# EAGLE schematic Sensirion_flowSensor (EAGLE 9.6.2)
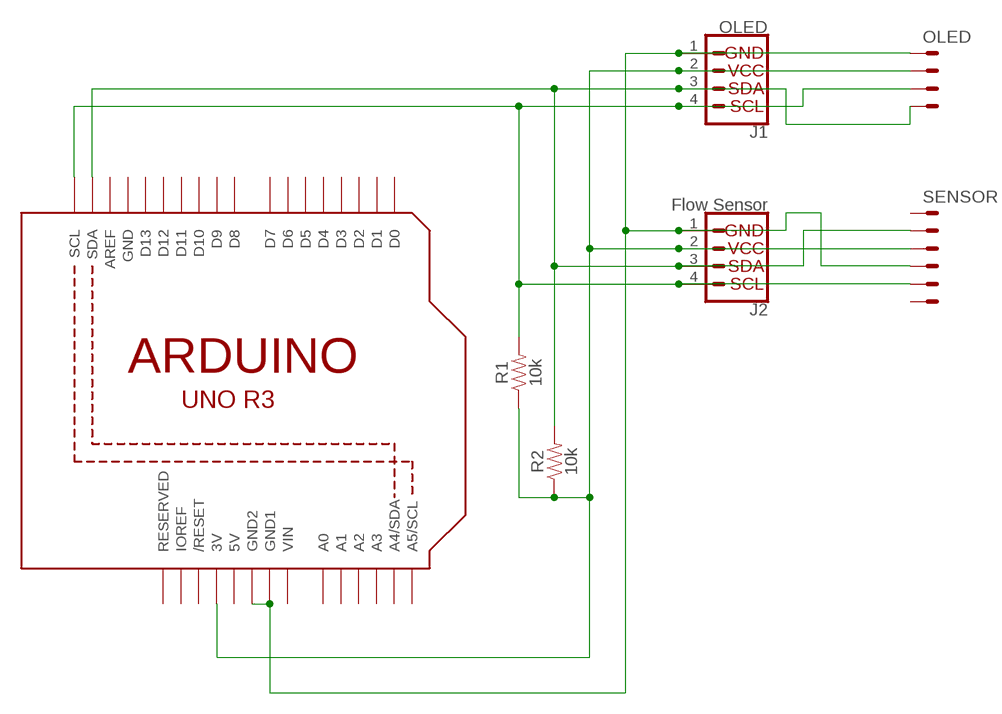
[diagram p0: schematic, sheet 1]

## Parts
FLOW  SENSOR  KK-156-6  [KK-156-6]
J1  OLED  QWIIC_CONNECTOR  [JST04_1MM_VERT]
J2  Flow Sensor  QWIIC_CONNECTOR  [JST04_1MM_VERT]
OLED  OLED  KK-156-4  [KK-156-4]
R1  10k  10KOHM-VERT-1/4W-1%  [AXIAL-0.1]
R2  10k  10KOHM-VERT-1/4W-1%  [AXIAL-0.1]
U1  ARDUINOR3-BPLACE  [ARDUINOR3-BPLACE]

## Nets
N$1: FLOW.5 J1.4 J2.4 OLED.3 R1.P$2 U1.SCL
N$2: FLOW.2 J1.3 J2.3 OLED.4 R2.P$2 U1.SDA
N$5: FLOW.3 J1.2 J2.2 OLED.2 R1.P$1 R2.P$1 U1.3V
N$6: FLOW.4 J1.1 J2.1 OLED.1 U1.GND1 U1.GND2
Unconnected: FLOW.1 FLOW.6 U1.A0 U1.A1 U1.A2 U1.A3 U1.A4(A4/SDA) U1.A5(A5/SCL) U1.AREF U1.D0 U1.D1 U1.D2 U1.D3 U1.D4 U1.D5 U1.D6 U1.D7 U1.D8 U1.D9 U1.D10 U1.D11 U1.D12 U1.D13 U1.IOREF U1.RESERVED U1.RESET(/RESET)

## Power pins joined to a net without a drawn wire
5V: U1.5V
GND: U1.GND
VIN: U1.VIN

## Library data of the parts
FLOW = con-molex:KK-156-6: KK 156 HEADER Source: http://www.molex.com/pdm_docs/sd/026604100_sd.pdf; MF: MOLEX; OC_FARNELL: unknown; OC_NEWARK: unknown
J1 J2 = SparkFun-Connectors:QWIIC_CONNECTOR: SparkFun I2C Standard Qwiic Connector An SMD 1mm pitch JST connector makes it easy and quick (get it? Qwiic?) to connect I2C devices to each other. The Qwiic system <http://www.sparkfun.com/qwiic> enables fast and solderless connection between popular platforms and various sensors and actuators. We carry 200mm <https://www.sparkfun.com/products/14204>, 100mm <https://www.sparkfun.com/products/14205>, 50mm <https://www.sparkfun.com/products/14206>, and breadboard friendly <https://www.sparkfun.com/products/14207> Qwiic cables. We also offer 10 pcs strips <https://www.sparkfun.com/products/14323> the SMD connectors.; PROD_ID: CONN-14483; VALUE: Vertical Qwiic Connector
OLED = con-molex:KK-156-4: KK 156 HEADER Source: http://www.molex.com/pdm_docs/sd/026604100_sd.pdf; MF: MOLEX; OC_FARNELL: unknown; OC_NEWARK: unknown
R1 R2 = SparkFun-Resistors:10KOHM: 10kΩ resistor A resistor is a passive two-terminal electrical component that implements electrical resistance as a circuit element. Resistors act to reduce current flow, and, at the same time, act to lower voltage levels within circuits. - Wikipedia; PROD_ID: RES-12183
U1 = adafruit:ARDUINOR3: This is a new object for the new Arduino R3 - with extra pins that you may want to use (such as IOref, and duplicated A4/A5